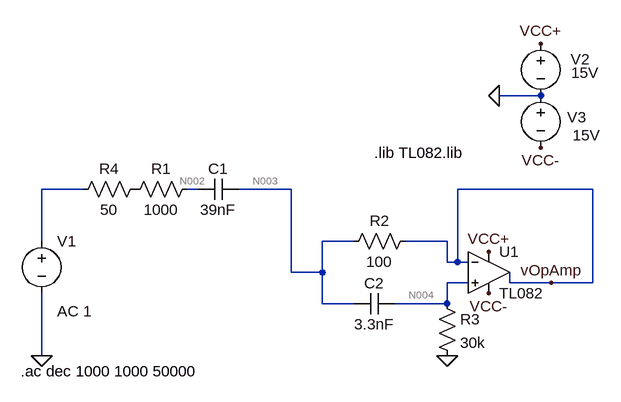
[diagram p0: schematic LP prueba feichu.asc]
LP prueba feichu.asc, the LTspice schematic file:
Version 4
SHEET 1 880 680
WIRE 432 64 368 64
WIRE -272 208 -336 208
WIRE -96 208 -112 208
WIRE 48 208 -32 208
WIRE 512 208 304 208
WIRE -336 288 -336 208
WIRE 144 288 96 288
WIRE 288 288 224 288
WIRE 288 320 288 288
WIRE 304 320 304 208
WIRE 304 320 288 320
WIRE 320 320 304 320
WIRE 48 336 48 208
WIRE 96 336 96 288
WIRE 96 336 48 336
WIRE 320 352 288 352
WIRE 384 352 384 336
WIRE 448 352 384 352
WIRE 512 352 512 208
WIRE 512 352 448 352
WIRE 96 384 96 336
WIRE 144 384 96 384
WIRE 288 384 288 352
WIRE 288 384 208 384
WIRE -336 464 -336 368
FLAG -336 464 0
FLAG 352 304 VCC+
FLAG 352 368 VCC-
FLAG 368 64 0
FLAG 432 -16 VCC+
FLAG 432 144 VCC-
FLAG 288 464 0
FLAG 448 352 vOpAmp
SYMBOL cap -32 192 R90
WINDOW 0 0 32 VBottom 2
WINDOW 3 32 32 VTop 2
SYMATTR InstName C1
SYMATTR Value 39nF
SYMBOL res -96 192 R90
WINDOW 0 0 56 VBottom 2
WINDOW 3 32 56 VTop 2
SYMATTR InstName R1
SYMATTR Value 1000
SYMBOL voltage -336 272 R0
WINDOW 123 24 124 Left 2
WINDOW 39 0 0 Left 2
SYMATTR Value2 AC 1
SYMATTR InstName V1
SYMATTR Value ""
SYMBOL res 240 272 R90
WINDOW 0 0 56 VBottom 2
WINDOW 3 32 56 VTop 2
SYMATTR InstName R2
SYMATTR Value 100
SYMBOL cap 208 368 R90
WINDOW 0 0 32 VBottom 2
WINDOW 3 32 32 VTop 2
SYMATTR InstName C2
SYMATTR Value 3.3nF
SYMBOL Opamps\\opamp2 352 272 R0
SYMATTR InstName U1
SYMATTR Value TL082
SYMBOL voltage 432 -32 R0
WINDOW 0 46 40 Left 2
WINDOW 3 47 61 Left 2
WINDOW 123 0 0 Left 2
WINDOW 39 0 0 Left 2
SYMATTR InstName V2
SYMATTR Value 15V
SYMBOL voltage 432 48 R0
WINDOW 0 41 49 Left 2
WINDOW 3 49 77 Left 2
SYMATTR InstName V3
SYMATTR Value 15V
SYMBOL res 272 368 R0
SYMATTR InstName R3
SYMATTR Value 30k
SYMBOL res -176 192 R90
WINDOW 0 0 56 VBottom 2
WINDOW 3 32 56 VTop 2
SYMATTR InstName R4
SYMATTR Value 50
TEXT -368 488 Left 2 !.ac dec 1000 1000 50000
TEXT 176 152 Left 2 !.lib TL082.lib

The netlist it stands for:
* LP prueba feichu.asc
C1 N003 N002 39nF
R1 N002 P001 1000
V1 N001 0 AC 1
R2 vOpAmp N003 100
C2 N004 N003 3.3nF
XU1 N004 vOpAmp VCC+ VCC- vOpAmp TL082  ; pins In+ In- V+ V- OUT
V2 VCC+ 0 15V
V3 0 VCC- 15V
R3 N004 0 30k
R4 P001 N001 50
.ac dec 1000 1000 50000
.lib TL082.lib
.backanno
.end

* Results of the author's LTspice run, read from the files saved beside the schematic
* Operating Point, zero values left out:
*   V(n003) = 9.619 µV
*   V(vopamp) = 9.619 µV
*   V(n004) = -1.352 µV
*   V(vcc-) = -15 V
*   V(vcc+) = 15 V
*   I(R3) = -45.05 pA
*   I(V3) = -14.19 mA
*   I(V2) = -14.19 mA
*   Ix(u1:1) = 45.05 pA
*   Ix(u1:2) = 45.05 pA
*   Ix(u1:3) = 14.19 mA
*   Ix(u1:4) = -14.19 mA
*   Ix(u1:5) = -45.05 pA
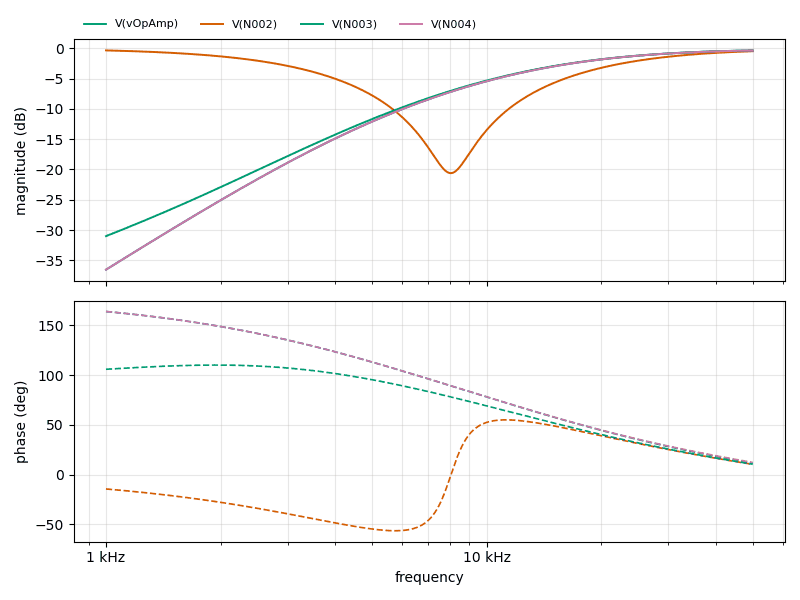
[diagram p1: AC Analysis of LP prueba feichu.asc, plotted from the saved traces]
* AC Analysis, 1 run:
*   V(vOpAmp): -36.54 dB at 1 kHz, -0.35 dB at 50 kHz, peak -0.35 dB at 50 kHz, 3 dB below the peak at 13.89 kHz
*   V(N002): -0.34 dB at 1 kHz, -0.47 dB at 50 kHz, peak -0.34 dB at 1 kHz, 3 dB below the peak at 3.239 kHz
*   V(N003): -31.00 dB at 1 kHz, -0.35 dB at 50 kHz, peak -0.35 dB at 50 kHz, 3 dB below the peak at 13.76 kHz
*   V(N004): -36.55 dB at 1 kHz, -0.35 dB at 50 kHz, peak -0.35 dB at 50 kHz, 3 dB below the peak at 13.9 kHz